# EAGLE design LEDMaster (EAGLE 7.6.0)
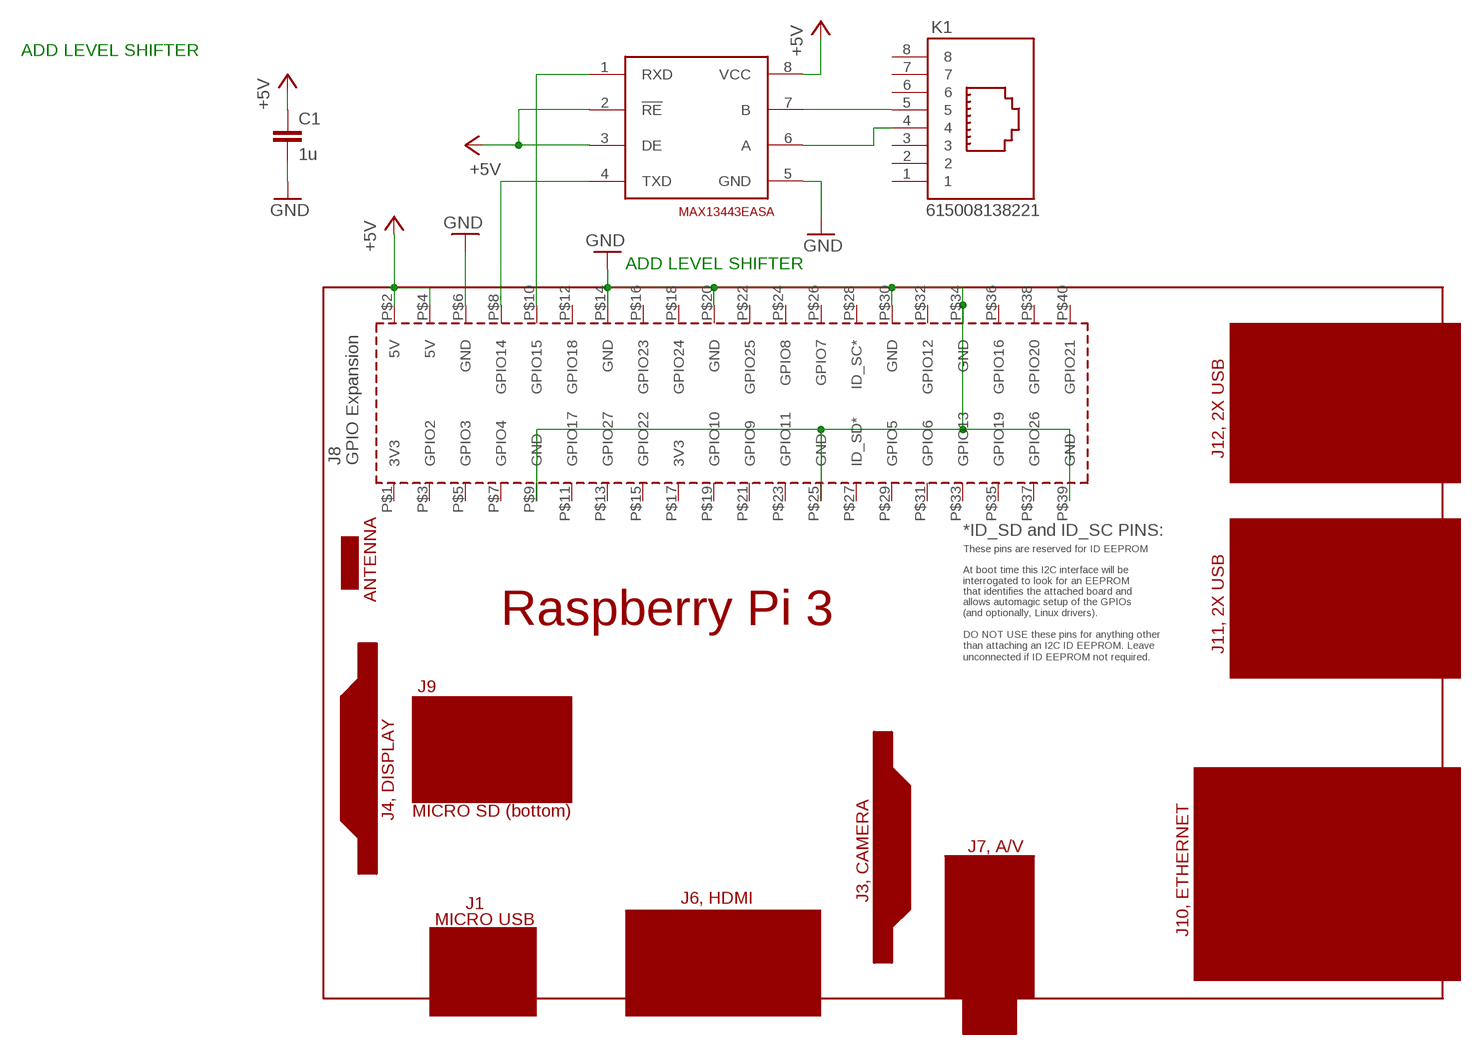
[diagram p0: schematic, sheet 1]

## Parts
C1  1u  C-EUC1206  [C1206]
K1  615008138221  [615008138221]
PCB1  RPI3  [RPI3]
U$1  MAX13443EASA  [SO08]

## Nets
+5V: C1.1 PCB1.P$2(5V) PCB1.P$4(5V) U$1.2(!RE) U$1.3(DE) U$1.8(VCC)
GND: C1.2 PCB1.P$6(GND) PCB1.P$9(GND) PCB1.P$14(GND) PCB1.P$20(GND) PCB1.P$25(GND) PCB1.P$30(GND) PCB1.P$34(GND) PCB1.P$39(GND) U$1.5(GND)
N$1: PCB1.P$8(GPIO14) U$1.4(TXD)
N$2: PCB1.P$10(GPIO15) U$1.1(RXD)
N$3: K1.5 U$1.7(B)
N$4: K1.4 U$1.6(A)
Unconnected: K1.1 K1.2 K1.3 K1.6 K1.7 K1.8 PCB1.P$1(3V3) PCB1.P$3(GPIO2) PCB1.P$5(GPIO3) PCB1.P$7(GPIO4) PCB1.P$11(GPIO17) PCB1.P$12(GPIO18) PCB1.P$13(GPIO27) PCB1.P$15(GPIO22) PCB1.P$16(GPIO23) PCB1.P$17(3V3) PCB1.P$18(GPIO24) PCB1.P$19(GPIO10) PCB1.P$21(GPIO9) PCB1.P$22(GPIO25) PCB1.P$23(GPIO11) PCB1.P$24(GPIO8) PCB1.P$26(GPIO7) PCB1.P$27(ID_SD*) PCB1.P$28(ID_SC*) PCB1.P$29(GPIO5) PCB1.P$31(GPIO6) PCB1.P$32(GPIO12) PCB1.P$33(GPIO13) PCB1.P$35(GPIO19) PCB1.P$36(GPIO16) PCB1.P$37(GPIO26) PCB1.P$38(GPIO20) PCB1.P$40(GPIO21)

## Notes on the sheet
- ADD LEVEL SHIFTER
- ADD LEVEL SHIFTER

## Library data of the parts
C1 = rcl:C-EU: CAPACITOR, European symbol
K1 = Input-Output_Connectors_rev15d:615008138221: WR-MJ Vertical Shielded 8P8C Front Post Modular Jack, 8 pins=>Code : Con_I-O_MJ-V_Shielded_615008138221 <http://katalog.we-online.de/media/images/eican/Con_I-O_MJ-V_Shielded_615008138221_pf2.jpg> Details see: http://katalog.we-online.de/en/em/615_008_138_221 Created 2014-07-10, Karrer Zheng 2014 (C) Würth Elektronik
PCB1 = e14_Rpi3_RevA:RPI3: Device for Raspberry Pi 3 board created by Dave Young for www.element14.com More information and support community is available at https://www.element14.com/community/community/raspberry-pi
U$1 = MAX13443EASA:MAX13443EASA

## Board
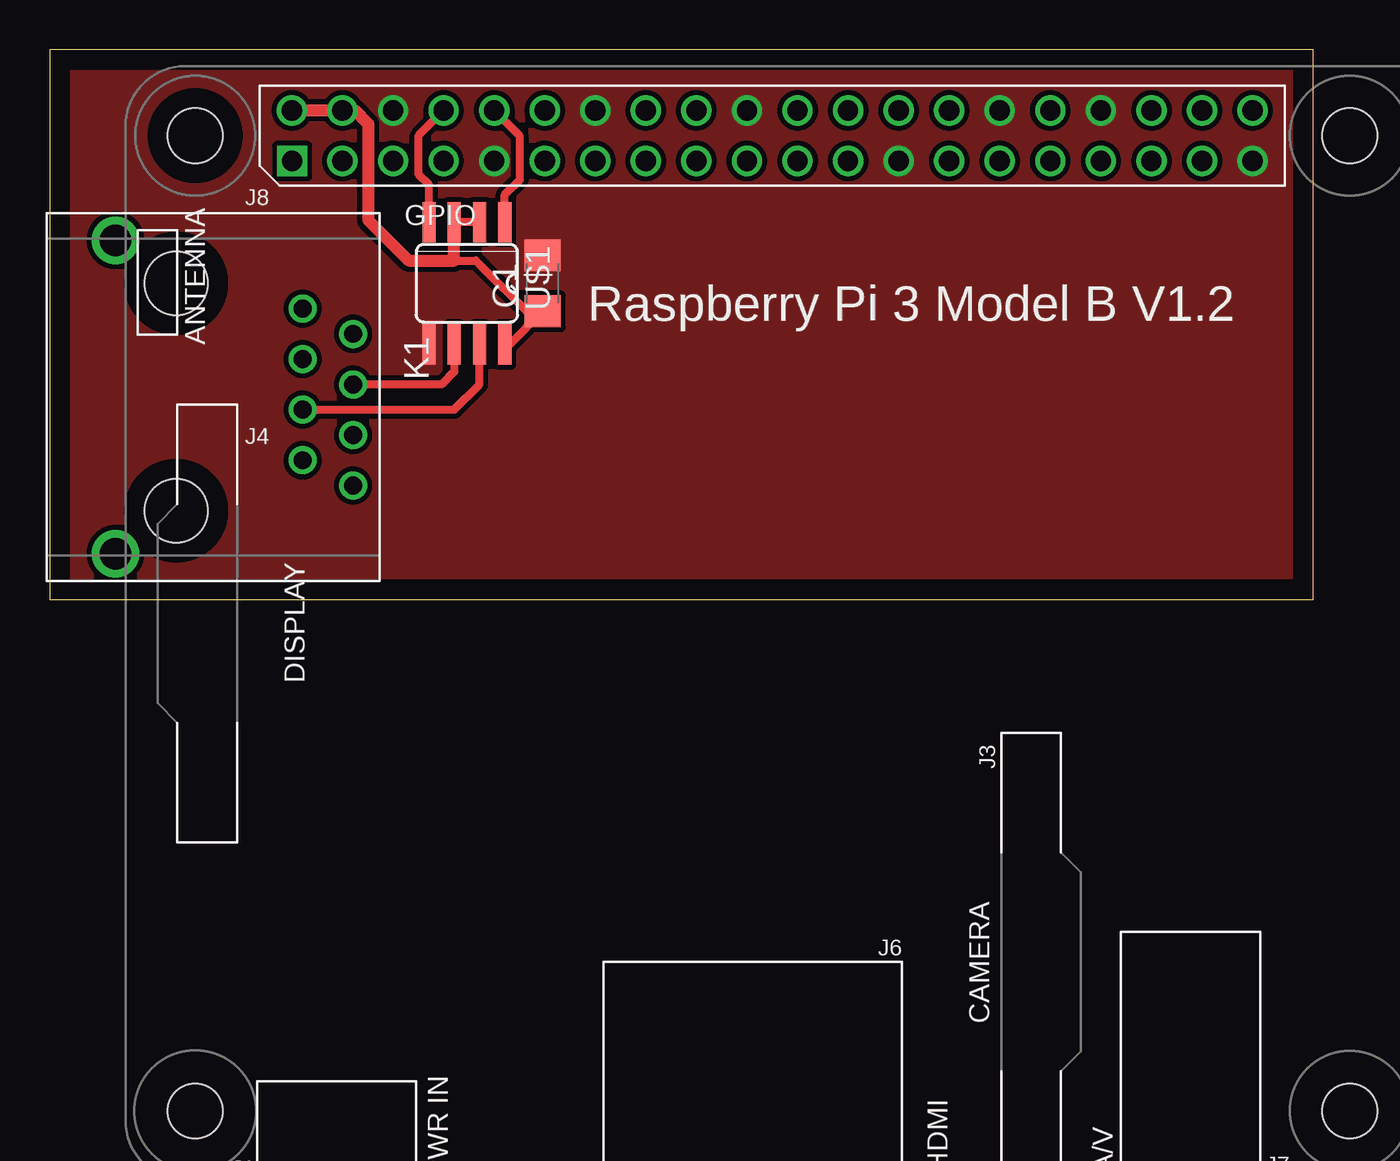
[diagram p1: board, top side]

Size 63.48 x 27.61 mm. Coordinates in mm from the lower left corner, seen from the top.
Outline: 0,0 63.48,0 63.48,27.61 0,27.61 0,0
Copper layers (1*16): Top 0.035mm / dielectric 1.5mm / Bottom 0.035mm
Design rules "default": minimum track width 10mil, minimum drill 24mil, track to track 8mil, track to pad 8mil, pad to pad 8mil, via to via 8mil, smd to smd 8mil, copper to edge 40mil, drill to drill 8mil, minimum pad ring 10mil, minimum via ring 8mil, stop-mask expansion 4mil, vias tented up to drill 0mil, thermal gap 10mil

### Footprints (pad centres in the part's own frame; a part is rotated, then mirrored left to right if it is on the bottom)
C1206 = smd 1.6 x 1.8: 1 -1.4,0; 2 1.4,0
615008138221 = drill 0.9: 1 -4.445,-1.27; 2 -3.175,1.27; 3 -1.905,-1.27; 4 -0.635,1.27; 5 0.635,-1.27; 6 1.905,1.27; 7 3.175,-1.27; 8 4.445,1.27 | drill 1.6: Z1 -7.875,-10.67; Z2 7.875,-10.67 | hole 3.17: -5.715,-7.62; 5.715,-7.62
RPI3 = drill 1.016 square: P$1 8.37,51.23 | drill 1.016: P$2 8.357,53.772; P$3 10.897,51.232; P$4 10.897,53.772; P$5 13.437,51.232; P$6 13.437,53.772; P$7 15.977,51.232; P$8 15.977,53.772; P$9 18.517,51.232; P$10 18.517,53.772; P$11 21.057,51.232; P$12 21.057,53.772; P$13 23.597,51.232; P$14 23.597,53.772; P$15 26.137,51.232; P$16 26.137,53.772; P$17 28.677,51.232; P$18 28.677,53.772; P$19 31.217,51.232; P$20 31.217,53.772; P$21 33.757,51.232; P$22 33.757,53.772; P$23 36.297,51.232; P$24 36.297,53.772; P$25 38.837,51.232; P$26 38.837,53.772; P$27 41.377,51.232; P$28 41.377,53.772; P$29 43.917,51.232; P$30 43.917,53.772; P$31 46.457,51.232; P$32 46.457,53.772; P$33 48.997,51.232; P$34 48.997,53.772; P$35 51.537,51.232; P$36 51.537,53.772; P$37 54.077,51.232; P$38 54.077,53.772; P$39 56.617,51.232; P$40 56.617,53.772 | hole 2.75: 3.5,3.5; 61.5,3.5; 3.5,52.5; 61.5,52.5
SO08 = smd 0.66 x 2.032: 1 -1.905,-3.073; 2 -0.635,-3.073; 3 0.635,-3.073; 4 1.905,-3.073; 5 1.905,3.073; 6 0.635,3.073; 7 -0.635,3.073; 8 -1.905,3.073

### Placement (x,y rotation side)
C1  24.76,15.88 90 top
K1  13.97,10.16 270 top
PCB1  3.81,-29.21 0 top
U$1  20.95,15.88 180 top

### Tracks (layer width: path | path; a pad name or v marks a point on that pad's centre or on a via)
+5V
  Top 0.406: U$1.8 23.09,12.8 C1.1 23.94,14.48 21.75,16.67 21.59,16.83 21.4,17.02 20.32,17.02 | U$1.2 U$1.3
  Top 0.61: PCB1.P$2 PCB1.P$4 15.32,24.56 16,23.88 16,19.05 18.03,17.02 20.32,17.02 U$1.3
GND
  pour Top (isolate 0.254, no thermals): 0,27.94 63.5,27.94 63.5,0 0,0
N$1
  Top 0.406: U$1.4 19.05,20.83 18.54,21.34 18.54,23.32 PCB1.P$8
N$2
  Top 0.406: U$1.1 22.86,20.32 23.62,21.08 23.62,23.27 PCB1.P$10
N$3
  Top 0.406: K1.5 20.32,9.52 21.59,10.79 U$1.7
N$4
  Top 0.406: U$1.6 20.32,11.43 19.68,10.79 K1.4